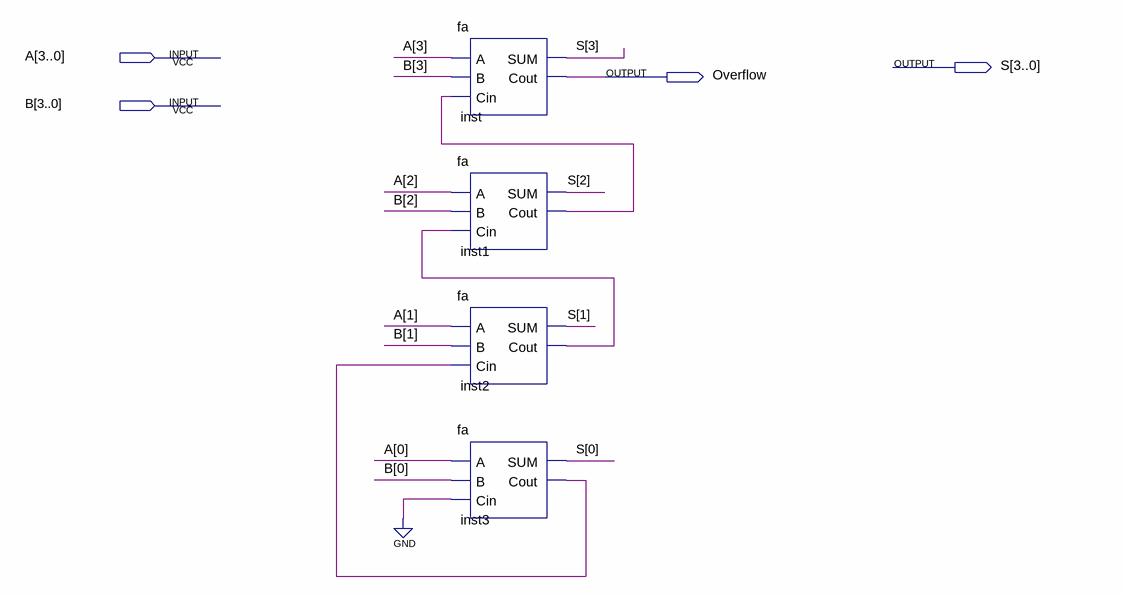
[diagram p0: schematic sheet]
// Quartus schematic rca.bdf as structural Verilog: 4 symbols, 4 pins
module rca (
  input  [3:0] A,
  input  [3:0] B,
  output [3:0] S,
  output Overflow
);

  wire inst1_cout, inst2_cout, inst3_cout;

  fa inst (.A(A[3]), .B(B[3]), .Cin(inst1_cout), .SUM(S[3]), .Cout(Overflow));
  fa inst1 (.A(A[2]), .B(B[2]), .Cin(inst2_cout), .SUM(S[2]), .Cout(inst1_cout));
  fa inst2 (.A(A[1]), .B(B[1]), .Cin(inst3_cout), .SUM(S[1]), .Cout(inst2_cout));
  fa inst3 (.A(A[0]), .B(B[0]), .Cin(1'b0), .SUM(S[0]), .Cout(inst3_cout));
endmodule
